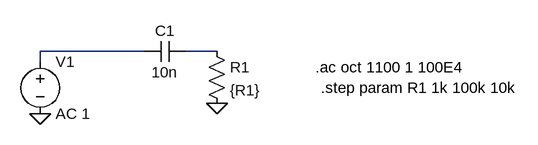
[diagram p0: schematic Draft1.asc]
Draft1.asc, the LTspice schematic file:
Version 4
SHEET 1 880 680
WIRE 256 304 96 304
WIRE 368 304 320 304
WIRE 96 320 96 304
FLAG 96 400 0
FLAG 368 384 0
SYMBOL voltage 96 304 R0
SYMATTR InstName V1
SYMATTR Value AC 1
SYMBOL res 352 288 R0
SYMATTR InstName R1
SYMATTR Value {R1}
SYMBOL cap 320 288 R90
WINDOW 0 0 32 VBottom 2
WINDOW 3 32 32 VTop 2
SYMATTR InstName C1
SYMATTR Value 10n
TEXT 520 328 Left 2 !.ac oct 1100 1 100E4
TEXT 528 360 Left 2 !.step param R1 1k 100k 10k

The netlist it stands for:
* Draft1.asc
V1 N001 0 AC 1
R1 N002 0 {R1}
C1 N002 N001 10n
.ac oct 1100 1 100E4
.step param R1 1k 100k 10k
.backanno
.end